# EAGLE schematic Rover_Power_Supply (EAGLE 7.7.0)
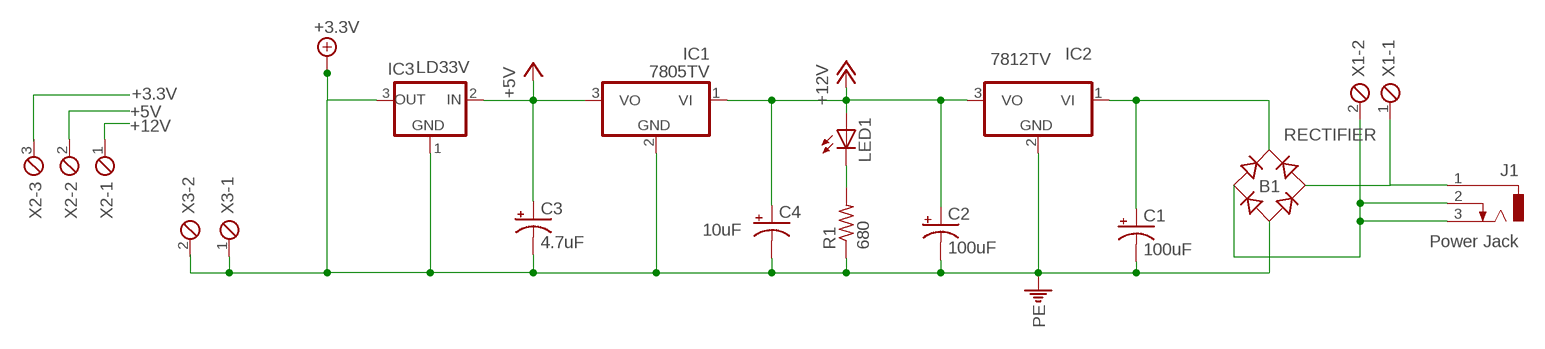
[diagram p0: schematic, sheet 1]

## Parts
B1  RECTIFIER  RB1A  [RB1A]
C1  100uF  CPOL-USE5-8.5  [E5-8,5]
C2  100uF  CPOL-USE5-8.5  [E5-8,5]
C3  4.7uF  CPOL-USE5-8.5  [E5-8,5]
C4  10uF  CPOL-USE5-8.5  [E5-8,5]
IC1  7805TV  [TO220V]
IC2  7812TV  [TO220V]
IC3  LD33V  78MXXS  [78MXXS]
J1  Power Jack  DCJ0303  [ROVER-PW-JACL]
LED1  LED3MM  [LED3MM]
R1  680  R-US_0204/5  [0204/5]
X1  MPT2  [2POL254]
X2  MPT3  [3POL254]
X3  MPT2  [2POL254]

## Nets
+5V: C3.+ IC1.3(VO) X2.2
+12V: C2.+ C4.+ IC1.1(VI) IC2.3(VO) LED1.A X2.1
N$1: IC3.IN
N$2: B1.AC1 J1.1 X1.1
N$3: B1.AC2 J1.2 J1.3 X1.2
N$4: LED1.K(C) R1.2
N$5: B1.+ C1.+ IC2.1(VI)
PE: B1.- C1.- C2.- C3.- C4.- IC1.2(GND) IC2.2(GND) IC3.GND IC3.OUT R1.1 X3.1
Unconnected: X2.3 X3.2

## Notes on the sheet
- 3 | 2
- 1

## Library data of the parts
B1 = rectifier:RB1A: RECTIFIER 1 A
C1-C4 = rcl:CPOL-US: POLARIZED CAPACITOR, American symbol
IC1 IC2 = linear:78*: Positive VOLTAGE REGULATOR Source: http://cache.national.com/ds/LM/LM78L05.pdf http://www.fairchildsemi.com/ds/LM/LM7805.pdf
IC3 = v-reg:78MXXS: VOLTAGE REGULATOR
J1 = Rover-PW-Jack:DCJ0303: DC POWER JACK Source: DCJ0303.pdf; OC_FARNELL: unknown; OC_NEWARK: unknown
LED1 = led:LED: LED OSRAM: - CHIPLED LG R971, LG N971, LY N971, LG Q971, LY Q971, LO R971, LY R971 LH N974, LH R974 LS Q976, LO Q976, LY Q976 LO Q996 - Hyper CHIPLED LW Q18S LB Q993, LB Q99A, LB R99A - SideLED LS A670, LO A670, LY A670, LG A670, LP A670 LB A673, LV A673, LT A673, LW A673 LH A674 LY A675 LS A676, LA A676, LO A676, LY A676, LW A676 LS A679, LY A679, LG A679 - Hyper Micro SIDELED® LS Y876, LA Y876, LO Y876, LY Y876 LT Y87S - SmartLED LW L88C, LW L88S LB L89C, LB L89S, LG L890 LS L89K, LO L89K, LY L89K LS L896, LA L896, LO L896, LY L896 - TOPLED LS T670, LO T670, LY T670, LG T670, LP T670 LSG T670, LSP T670, LSY T670, LOP T670, LYG T670 LG T671, LOG T671, LSG T671 LB T673, LV T673, LT T673, LW T673 LH T674 LS T676, LA T676, LO T676, LY T676, LB T676, LH T676, LSB T676, LW T676 LB T67C, LV T67C, LT T67C, LS T67K, LO T67K, LY T67K, LW E67C LS E67B, LA E67B, LO E67B, LY E67B, LB E67C, LV E67C, LT E67C LW T67C LS T679, LY T679, LG T679 LS T770, LO T770, LY T770, LG T770, LP T770 LB T773, LV T773, LT T773, LW T773 LH T774 LS E675, LA E675, LY E675, LS T675 LS T776, LA T776, LO T776, LY T776, LB T776 LHGB T686 LT T68C, LB T68C - Hyper Mini TOPLED® LB M676 - Mini TOPLED Santana® LG M470 LS M47K, LO M47K, LY M47K Source: http://www.osram.convergy.de LUXEON: - LUMILED® LXK2-PW12-R00, LXK2-PW12-S00, LXK2-PW14-U00, LXK2-PW14-V00 LXK2-PM12-R00, LXK2-PM12-S00, LXK2-PM14-U00 LXK2-PE12-Q00, LXK2-PE12-R00, LXK2-PE12-S00, LXK2-PE14-T00, LXK2-PE14-U00 LXK2-PB12-K00, LXK2-PB12-L00, LXK2-PB12-M00, LXK2-PB14-N00, LXK2-PB14-P00, LXK2-PB14-Q00 LXK2-PR12-L00, LXK2-PR12-M00, LXK2-PR14-Q00, LXK2-PR14-R00 LXK2-PD12-Q00, LXK2-PD12-R00, LXK2-PD12-S00 LXK2-PH12-R00, LXK2-PH12-S00 LXK2-PL12-P00, LXK2-PL12-Q00, LXK2-PL12-R00 Source: www.luxeon.com KINGBRIGHT: KA-3528ASYC Source: www.kingbright.com
R1 = rcl:R-US_: RESISTOR, American symbol
X1 X3 = con-phoenix-254:MPT2: PHOENIX CONNECTOR; OC_FARNELL: unknown; OC_NEWARK: unknown
X2 = con-phoenix-254:MPT3: PHOENIX CONNECTOR; OC_FARNELL: unknown; OC_NEWARK: unknown